# Altium schematic sheet rf_main6.SchDoc: mcHF QRP Transceiver RF board
size A4; Author: K Atanassov; CompanyName: M0NKA; Revision: 0.6.3; SheetTotal: 12
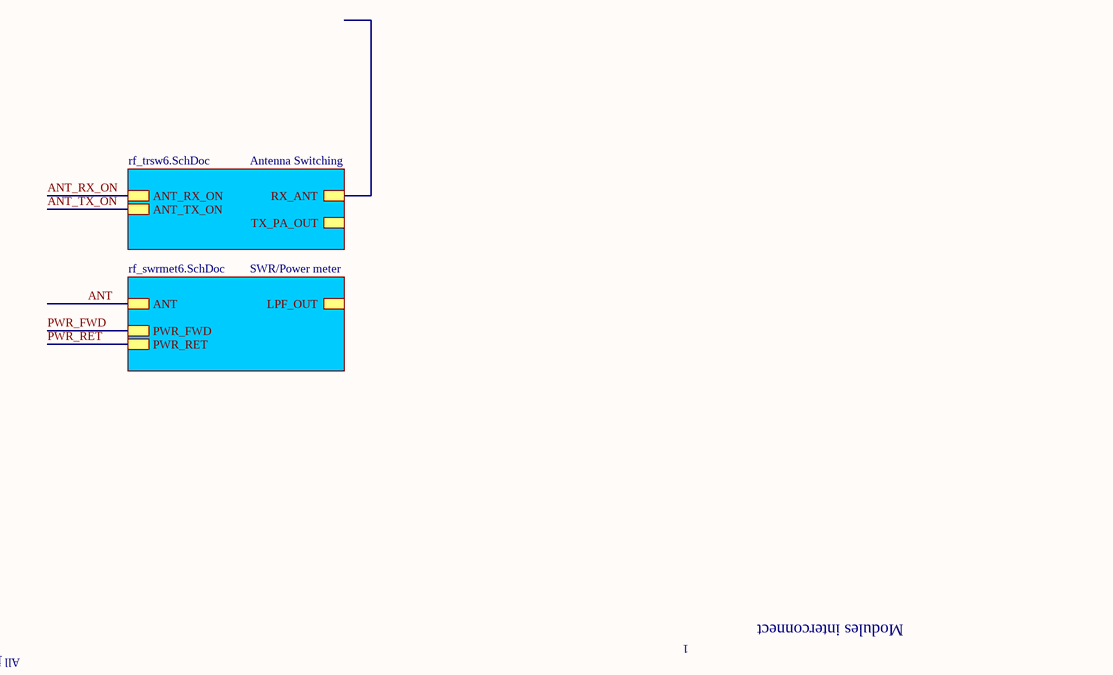
[diagram p0: rf_main6.SchDoc]

## Sub-sheets
Antenna Switching = rf_trsw6.SchDoc: RX_ANT, ANT_RX_ON, ANT_TX_ON, TX_PA_OUT
SWR/Power meter = rf_swrmet6.SchDoc: ANT, LPF_OUT, PWR_FWD, PWR_RET

## Nets
ANT: sheet SWR/Power meter/ANT
ANT_RX_ON: sheet Antenna Switching/ANT_RX_ON
ANT_TX_ON: sheet Antenna Switching/ANT_TX_ON
PWR_FWD: sheet SWR/Power meter/PWR_FWD
PWR_RET: sheet SWR/Power meter/PWR_RET

## Notes on the sheet
- All jumpers installed by default, remove selectively to bypass modules during testing
- 1
- Modules interconnect
- Date:
- Revision:
- Sheet
- of
- File: